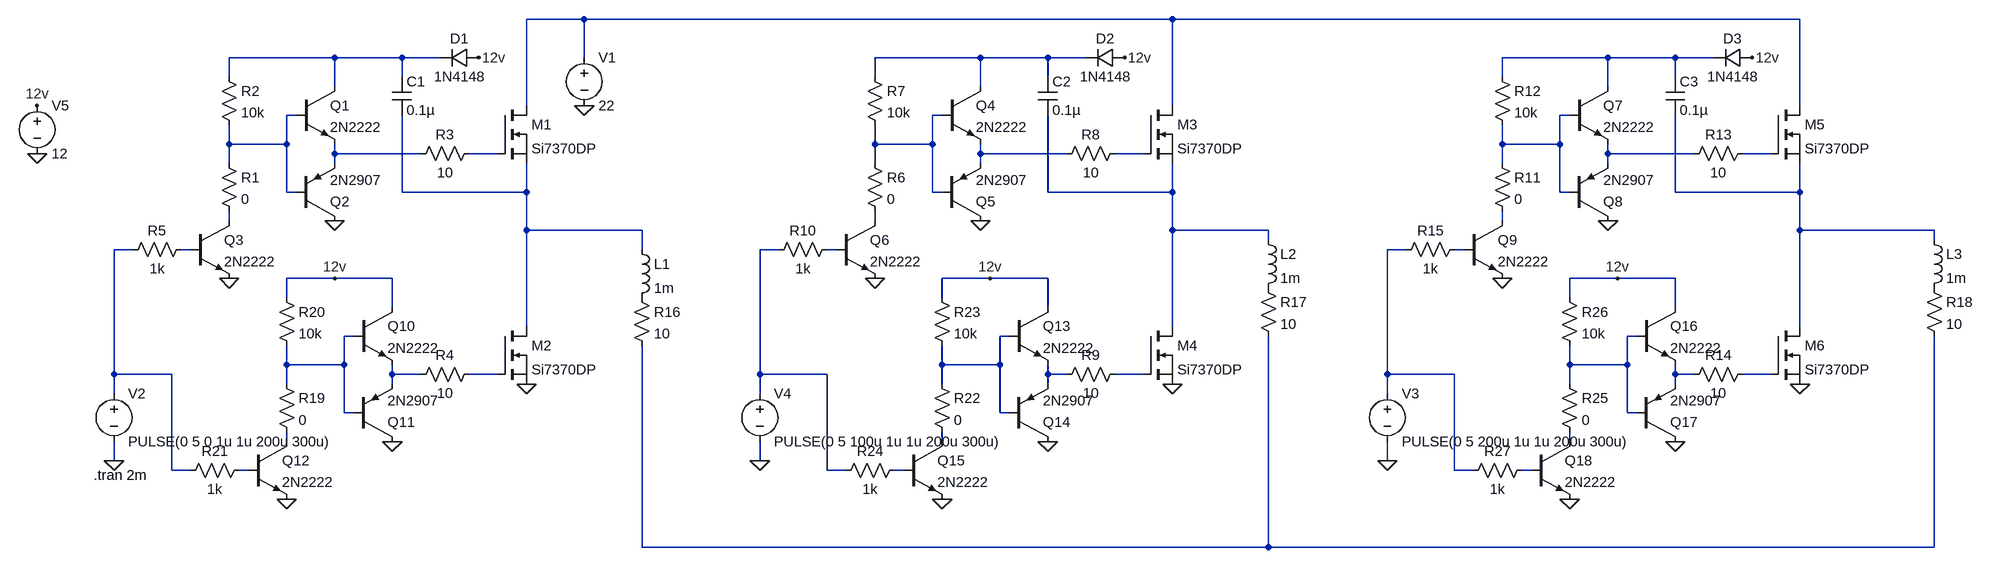
[diagram p0: schematic 3_phase_motor_driver.asc]
3_phase_motor_driver.asc, the LTspice schematic file:
Version 4
SHEET 1 2676 1300
WIRE 304 -112 208 -112
WIRE 1328 -112 304 -112
WIRE 2384 -112 1328 -112
WIRE -112 -48 -288 -48
WIRE 0 -48 -112 -48
WIRE 64 -48 0 -48
WIRE 304 -48 304 -112
WIRE 1008 -48 832 -48
WIRE 1120 -48 1008 -48
WIRE 1184 -48 1120 -48
WIRE 2064 -48 1888 -48
WIRE 2176 -48 2064 -48
WIRE 2240 -48 2176 -48
WIRE -288 -16 -288 -48
WIRE 0 -16 0 -48
WIRE 832 -16 832 -48
WIRE 1120 -16 1120 -48
WIRE 1888 -16 1888 -48
WIRE 2176 -16 2176 -48
WIRE -112 0 -112 -48
WIRE 1008 0 1008 -48
WIRE 2064 0 2064 -48
WIRE 208 32 208 -112
WIRE 1328 32 1328 -112
WIRE 2384 32 2384 -112
WIRE -176 48 -192 48
WIRE 944 48 928 48
WIRE 2000 48 1984 48
WIRE -288 96 -288 64
WIRE -192 96 -192 48
WIRE -192 96 -288 96
WIRE 832 96 832 64
WIRE 928 96 928 48
WIRE 928 96 832 96
WIRE 1888 96 1888 64
WIRE 1984 96 1984 48
WIRE 1984 96 1888 96
WIRE -112 112 -112 96
WIRE 32 112 -112 112
WIRE 160 112 112 112
WIRE 1008 112 1008 96
WIRE 1152 112 1008 112
WIRE 1280 112 1232 112
WIRE 2064 112 2064 96
WIRE 2208 112 2064 112
WIRE 2336 112 2288 112
WIRE -288 128 -288 96
WIRE -112 128 -112 112
WIRE 832 128 832 96
WIRE 1008 128 1008 112
WIRE 1888 128 1888 96
WIRE 2064 128 2064 112
WIRE -192 176 -192 96
WIRE -176 176 -192 176
WIRE 0 176 0 48
WIRE 208 176 208 128
WIRE 208 176 0 176
WIRE 928 176 928 96
WIRE 944 176 928 176
WIRE 1120 176 1120 48
WIRE 1328 176 1328 128
WIRE 1328 176 1120 176
WIRE 1984 176 1984 96
WIRE 2000 176 1984 176
WIRE 2176 176 2176 48
WIRE 2384 176 2384 128
WIRE 2384 176 2176 176
WIRE -288 224 -288 208
WIRE 832 224 832 208
WIRE 1888 224 1888 208
WIRE 208 240 208 176
WIRE 400 240 208 240
WIRE 1328 240 1328 176
WIRE 1488 240 1328 240
WIRE 2384 240 2384 176
WIRE 2608 240 2384 240
WIRE 1488 256 1488 240
WIRE 2608 256 2608 240
WIRE -448 272 -480 272
WIRE -352 272 -368 272
WIRE 400 272 400 240
WIRE 672 272 640 272
WIRE 768 272 752 272
WIRE 1728 272 1696 272
WIRE 1824 272 1808 272
WIRE -112 320 -192 320
WIRE -16 320 -112 320
WIRE 1024 320 944 320
WIRE 1120 320 1024 320
WIRE 2080 320 2000 320
WIRE 2176 320 2080 320
WIRE -192 352 -192 320
WIRE 944 352 944 320
WIRE 2000 352 2000 320
WIRE -16 368 -16 320
WIRE 1120 368 1120 320
WIRE 2176 368 2176 320
WIRE 208 400 208 240
WIRE 1328 400 1328 240
WIRE 2384 400 2384 240
WIRE -80 416 -96 416
WIRE 1056 416 1040 416
WIRE 2112 416 2096 416
WIRE -192 464 -192 432
WIRE -96 464 -96 416
WIRE -96 464 -192 464
WIRE 944 464 944 432
WIRE 1040 464 1040 416
WIRE 1040 464 944 464
WIRE 2000 464 2000 432
WIRE 2096 464 2096 416
WIRE 2096 464 2000 464
WIRE -480 480 -480 272
WIRE -384 480 -480 480
WIRE -16 480 -16 464
WIRE 32 480 -16 480
WIRE 160 480 112 480
WIRE 640 480 640 272
WIRE 752 480 640 480
WIRE 1120 480 1120 464
WIRE 1152 480 1120 480
WIRE 1280 480 1232 480
WIRE 1696 480 1696 272
WIRE 1808 480 1696 480
WIRE 2176 480 2176 464
WIRE 2208 480 2176 480
WIRE 2336 480 2288 480
WIRE -192 496 -192 464
WIRE -16 496 -16 480
WIRE 944 496 944 464
WIRE 1120 496 1120 480
WIRE 2000 496 2000 464
WIRE 2176 496 2176 480
WIRE -480 512 -480 480
WIRE 640 512 640 480
WIRE 1696 512 1696 480
WIRE -96 544 -96 464
WIRE -80 544 -96 544
WIRE 1040 544 1040 464
WIRE 1056 544 1040 544
WIRE 2096 544 2096 464
WIRE 2112 544 2096 544
WIRE -192 592 -192 576
WIRE 944 592 944 576
WIRE 2000 592 2000 576
WIRE -480 624 -480 592
WIRE 640 624 640 592
WIRE 1696 624 1696 592
WIRE -384 640 -384 480
WIRE -352 640 -384 640
WIRE -256 640 -272 640
WIRE 752 640 752 480
WIRE 784 640 752 640
WIRE 880 640 864 640
WIRE 1808 640 1808 480
WIRE 1840 640 1808 640
WIRE 1936 640 1920 640
WIRE 400 768 400 432
WIRE 1488 768 1488 416
WIRE 1488 768 400 768
WIRE 2608 768 2608 416
WIRE 2608 768 1488 768
FLAG 208 496 0
FLAG -112 224 0
FLAG -288 320 0
FLAG 304 32 0
FLAG -480 624 0
FLAG 1328 496 0
FLAG 1008 224 0
FLAG 832 320 0
FLAG 640 624 0
FLAG 2384 496 0
FLAG 2064 224 0
FLAG 1888 320 0
FLAG 1696 624 0
FLAG -16 592 0
FLAG -192 688 0
FLAG -608 112 0
FLAG -608 32 12v
FLAG 128 -48 12v
FLAG -112 320 12v
FLAG 1248 -48 12v
FLAG 2304 -48 12v
FLAG 1120 592 0
FLAG 944 688 0
FLAG 1024 320 12v
FLAG 2176 592 0
FLAG 2000 688 0
FLAG 2080 320 12v
SYMBOL nmos 160 32 R0
SYMATTR InstName M1
SYMATTR Value Si7370DP
SYMBOL nmos 160 400 R0
SYMATTR InstName M2
SYMATTR Value Si7370DP
SYMBOL voltage 304 -64 R0
SYMATTR InstName V1
SYMATTR Value 22
SYMBOL voltage -480 496 R0
WINDOW 123 0 0 Left 0
WINDOW 39 0 0 Left 0
SYMATTR InstName V2
SYMATTR Value PULSE(0 5 0 1u 1u 200u 300u)
SYMBOL npn -176 0 R0
SYMATTR InstName Q1
SYMATTR Value 2N2222
SYMBOL pnp -176 224 M180
SYMATTR InstName Q2
SYMATTR Value 2N2907
SYMBOL npn -352 224 R0
SYMATTR InstName Q3
SYMATTR Value 2N2222
SYMBOL res -304 112 R0
SYMATTR InstName R1
SYMATTR Value 0
SYMBOL res -304 -32 R0
SYMATTR InstName R2
SYMATTR Value 10k
SYMBOL cap -16 -16 R0
SYMATTR InstName C1
SYMATTR Value 0.1µ
SYMBOL diode 128 -64 R90
WINDOW 0 0 32 VBottom 2
WINDOW 3 32 32 VTop 2
SYMATTR InstName D1
SYMATTR Value 1N4148
SYMBOL res 128 96 R90
WINDOW 0 0 56 VBottom 2
WINDOW 3 32 56 VTop 2
SYMATTR InstName R3
SYMATTR Value 10
SYMBOL res 128 464 R90
WINDOW 0 0 56 VBottom 2
WINDOW 3 32 56 VTop 2
SYMATTR InstName R4
SYMATTR Value 10
SYMBOL res -352 256 R90
WINDOW 0 0 56 VBottom 2
WINDOW 3 32 56 VTop 2
SYMATTR InstName R5
SYMATTR Value 1k
SYMBOL nmos 1280 32 R0
SYMATTR InstName M3
SYMATTR Value Si7370DP
SYMBOL nmos 1280 400 R0
SYMATTR InstName M4
SYMATTR Value Si7370DP
SYMBOL voltage 640 496 R0
WINDOW 123 0 0 Left 0
WINDOW 39 0 0 Left 0
SYMATTR InstName V4
SYMATTR Value PULSE(0 5 100u 1u 1u 200u 300u)
SYMBOL npn 944 0 R0
SYMATTR InstName Q4
SYMATTR Value 2N2222
SYMBOL pnp 944 224 M180
SYMATTR InstName Q5
SYMATTR Value 2N2907
SYMBOL npn 768 224 R0
SYMATTR InstName Q6
SYMATTR Value 2N2222
SYMBOL res 816 112 R0
SYMATTR InstName R6
SYMATTR Value 0
SYMBOL res 816 -32 R0
SYMATTR InstName R7
SYMATTR Value 10k
SYMBOL cap 1104 -16 R0
SYMATTR InstName C2
SYMATTR Value 0.1µ
SYMBOL diode 1248 -64 R90
WINDOW 0 0 32 VBottom 2
WINDOW 3 32 32 VTop 2
SYMATTR InstName D2
SYMATTR Value 1N4148
SYMBOL res 1248 96 R90
WINDOW 0 0 56 VBottom 2
WINDOW 3 32 56 VTop 2
SYMATTR InstName R8
SYMATTR Value 10
SYMBOL res 1248 464 R90
WINDOW 0 0 56 VBottom 2
WINDOW 3 32 56 VTop 2
SYMATTR InstName R9
SYMATTR Value 10
SYMBOL res 768 256 R90
WINDOW 0 0 56 VBottom 2
WINDOW 3 32 56 VTop 2
SYMATTR InstName R10
SYMATTR Value 1k
SYMBOL nmos 2336 32 R0
SYMATTR InstName M5
SYMATTR Value Si7370DP
SYMBOL nmos 2336 400 R0
SYMATTR InstName M6
SYMATTR Value Si7370DP
SYMBOL voltage 1696 496 R0
WINDOW 123 0 0 Left 0
WINDOW 39 0 0 Left 0
SYMATTR InstName V3
SYMATTR Value PULSE(0 5 200u 1u 1u 200u 300u)
SYMBOL npn 2000 0 R0
SYMATTR InstName Q7
SYMATTR Value 2N2222
SYMBOL pnp 2000 224 M180
SYMATTR InstName Q8
SYMATTR Value 2N2907
SYMBOL npn 1824 224 R0
SYMATTR InstName Q9
SYMATTR Value 2N2222
SYMBOL res 1872 112 R0
SYMATTR InstName R11
SYMATTR Value 0
SYMBOL res 1872 -32 R0
SYMATTR InstName R12
SYMATTR Value 10k
SYMBOL cap 2160 -16 R0
SYMATTR InstName C3
SYMATTR Value 0.1µ
SYMBOL diode 2304 -64 R90
WINDOW 0 0 32 VBottom 2
WINDOW 3 32 32 VTop 2
SYMATTR InstName D3
SYMATTR Value 1N4148
SYMBOL res 2304 96 R90
WINDOW 0 0 56 VBottom 2
WINDOW 3 32 56 VTop 2
SYMATTR InstName R13
SYMATTR Value 10
SYMBOL res 2304 464 R90
WINDOW 0 0 56 VBottom 2
WINDOW 3 32 56 VTop 2
SYMATTR InstName R14
SYMATTR Value 10
SYMBOL res 1824 256 R90
WINDOW 0 0 56 VBottom 2
WINDOW 3 32 56 VTop 2
SYMATTR InstName R15
SYMATTR Value 1k
SYMBOL ind 384 256 R0
SYMATTR InstName L1
SYMATTR Value 1m
SYMBOL ind 1472 240 R0
SYMATTR InstName L2
SYMATTR Value 1m
SYMBOL ind 2592 240 R0
SYMATTR InstName L3
SYMATTR Value 1m
SYMBOL res 384 336 R0
SYMATTR InstName R16
SYMATTR Value 10
SYMBOL res 1472 320 R0
SYMATTR InstName R17
SYMATTR Value 10
SYMBOL res 2592 320 R0
SYMATTR InstName R18
SYMATTR Value 10
SYMBOL npn -80 368 R0
SYMATTR InstName Q10
SYMATTR Value 2N2222
SYMBOL pnp -80 592 M180
SYMATTR InstName Q11
SYMATTR Value 2N2907
SYMBOL npn -256 592 R0
SYMATTR InstName Q12
SYMATTR Value 2N2222
SYMBOL res -208 480 R0
SYMATTR InstName R19
SYMATTR Value 0
SYMBOL res -208 336 R0
SYMATTR InstName R20
SYMATTR Value 10k
SYMBOL res -256 624 R90
WINDOW 0 0 56 VBottom 2
WINDOW 3 32 56 VTop 2
SYMATTR InstName R21
SYMATTR Value 1k
SYMBOL voltage -608 16 R0
SYMATTR InstName V5
SYMATTR Value 12
SYMBOL npn 1056 368 R0
SYMATTR InstName Q13
SYMATTR Value 2N2222
SYMBOL pnp 1056 592 M180
SYMATTR InstName Q14
SYMATTR Value 2N2907
SYMBOL npn 880 592 R0
SYMATTR InstName Q15
SYMATTR Value 2N2222
SYMBOL res 928 480 R0
SYMATTR InstName R22
SYMATTR Value 0
SYMBOL res 928 336 R0
SYMATTR InstName R23
SYMATTR Value 10k
SYMBOL res 880 624 R90
WINDOW 0 0 56 VBottom 2
WINDOW 3 32 56 VTop 2
SYMATTR InstName R24
SYMATTR Value 1k
SYMBOL npn 2112 368 R0
SYMATTR InstName Q16
SYMATTR Value 2N2222
SYMBOL pnp 2112 592 M180
SYMATTR InstName Q17
SYMATTR Value 2N2907
SYMBOL npn 1936 592 R0
SYMATTR InstName Q18
SYMATTR Value 2N2222
SYMBOL res 1984 480 R0
SYMATTR InstName R25
SYMATTR Value 0
SYMBOL res 1984 336 R0
SYMATTR InstName R26
SYMATTR Value 10k
SYMBOL res 1936 624 R90
WINDOW 0 0 56 VBottom 2
WINDOW 3 32 56 VTop 2
SYMATTR InstName R27
SYMATTR Value 1k
TEXT -514 648 Left 2 !.tran 2m

The netlist it stands for:
* 3_phase_motor_driver.asc
M1 N001 N009 N014 N014 Si7370DP
M2 N014 N030 0 0 Si7370DP
V1 N001 0 22
V2 N020 0 PULSE(0 5 0 1u 1u 200u 300u)
Q1 N002 N005 N008 0 2N2222
Q2 0 N005 N008 0 2N2907
Q3 N017 N021 0 0 2N2222
R1 N005 N017 0
R2 N002 N005 10k
C1 N002 N014 0.1µ
D1 12v N002 1N4148
R3 N009 N008 10
R4 N030 N029 10
R5 N021 N020 1k
M3 N001 N011 N015 N015 Si7370DP
M4 N015 N032 0 0 Si7370DP
V4 N022 0 PULSE(0 5 100u 1u 1u 200u 300u)
Q4 N003 N006 N010 0 2N2222
Q5 0 N006 N010 0 2N2907
Q6 N018 N023 0 0 2N2222
R6 N006 N018 0
R7 N003 N006 10k
C2 N003 N015 0.1µ
D2 12v N003 1N4148
R8 N011 N010 10
R9 N032 N031 10
R10 N023 N022 1k
M5 N001 N013 N016 N016 Si7370DP
M6 N016 N034 0 0 Si7370DP
V3 N024 0 PULSE(0 5 200u 1u 1u 200u 300u)
Q7 N004 N007 N012 0 2N2222
Q8 0 N007 N012 0 2N2907
Q9 N019 N025 0 0 2N2222
R11 N007 N019 0
R12 N004 N007 10k
C3 N004 N016 0.1µ
D3 12v N004 1N4148
R13 N013 N012 10
R14 N034 N033 10
R15 N025 N024 1k
L1 N014 P001 1m
L2 N015 P002 1m
L3 N016 P003 1m
R16 P001 N041 10
R17 P002 N041 10
R18 P003 N041 10
Q10 12v N026 N029 0 2N2222
Q11 0 N026 N029 0 2N2907
Q12 N035 N038 0 0 2N2222
R19 N026 N035 0
R20 12v N026 10k
R21 N038 N020 1k
V5 12v 0 12
Q13 12v N027 N031 0 2N2222
Q14 0 N027 N031 0 2N2907
Q15 N036 N039 0 0 2N2222
R22 N027 N036 0
R23 12v N027 10k
R24 N039 N022 1k
Q16 12v N028 N033 0 2N2222
Q17 0 N028 N033 0 2N2907
Q18 N037 N040 0 0 2N2222
R25 N028 N037 0
R26 12v N028 10k
R27 N040 N024 1k
.model D D
.lib standard.dio
.model NPN NPN
.model PNP PNP
.lib standard.bjt
.model NMOS NMOS
.model PMOS PMOS
.lib standard.mos
.tran 2m
.backanno
.end